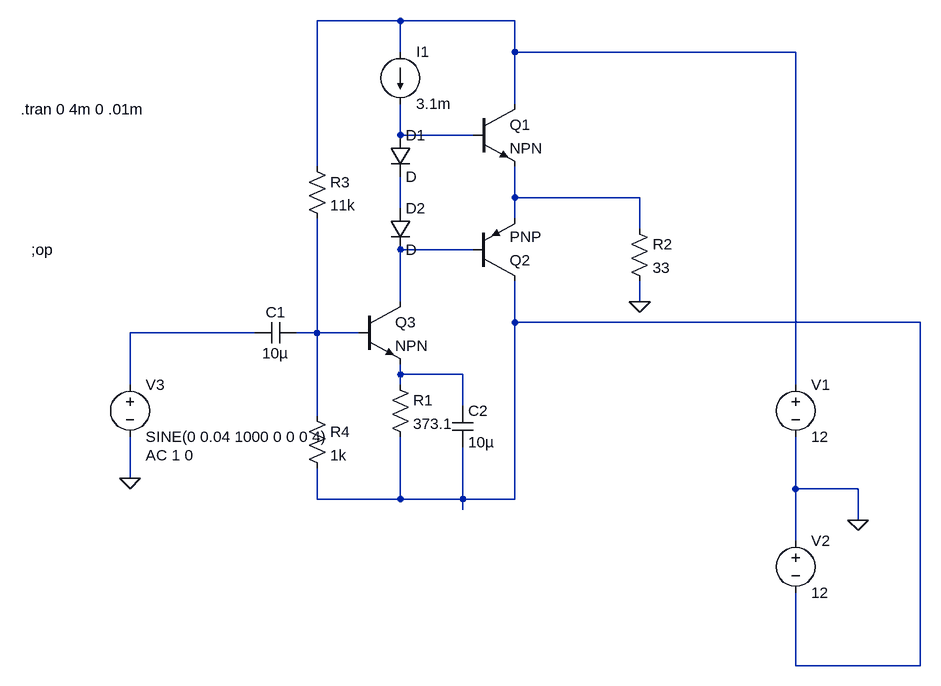
[diagram p0: schematic claseab4.asc]
claseab4.asc, the LTspice schematic file:
Version 4
SHEET 1 884 680
WIRE 80 -560 -48 -560
WIRE 256 -560 80 -560
WIRE 80 -512 80 -560
WIRE 256 -512 256 -560
WIRE 688 -512 256 -512
WIRE 256 -432 256 -512
WIRE 80 -384 80 -432
WIRE 192 -384 80 -384
WIRE -48 -336 -48 -560
WIRE 256 -288 256 -336
WIRE 336 -288 256 -288
WIRE 448 -288 336 -288
WIRE 80 -272 80 -320
WIRE 256 -256 256 -288
WIRE 448 -240 448 -288
WIRE 192 -208 80 -208
WIRE 80 -160 80 -208
WIRE 80 -128 80 -160
WIRE 448 -128 448 -160
WIRE 256 -96 256 -160
WIRE 880 -96 256 -96
WIRE -144 -80 -336 -80
WIRE -48 -80 -48 -256
WIRE -48 -80 -80 -80
WIRE 16 -80 -48 -80
WIRE 80 -16 80 -32
WIRE 176 -16 80 -16
WIRE -336 0 -336 -80
WIRE 80 0 80 -16
WIRE 688 0 688 -512
WIRE 176 32 176 -16
WIRE -48 48 -48 -80
WIRE -336 144 -336 80
WIRE 688 160 688 80
WIRE 784 160 688 160
WIRE -48 176 -48 128
WIRE 80 176 80 80
WIRE 80 176 -48 176
WIRE 176 176 176 96
WIRE 176 176 80 176
WIRE 256 176 256 -96
WIRE 256 176 176 176
WIRE 176 192 176 176
WIRE 784 208 784 160
WIRE 688 240 688 160
WIRE 688 432 688 320
WIRE 880 432 880 -96
WIRE 880 432 688 432
FLAG 784 208 0
FLAG -336 144 0
FLAG 448 -128 0
DATAFLAG 80 -160 ""
DATAFLAG 336 -288 ""
DATAFLAG 80 -16 ""
SYMBOL voltage 688 -16 R0
WINDOW 123 0 0 Left 2
WINDOW 39 0 0 Left 2
SYMATTR InstName V1
SYMATTR Value 12
SYMBOL voltage 688 224 R0
WINDOW 123 0 0 Left 2
WINDOW 39 0 0 Left 2
SYMATTR InstName V2
SYMATTR Value 12
SYMBOL voltage -336 -16 R0
WINDOW 123 24 124 Left 2
WINDOW 39 0 0 Left 2
SYMATTR Value2 AC 1 0
SYMATTR InstName V3
SYMATTR Value SINE(0 0.04 1000 0 0 0 4)
SYMBOL diode 64 -384 R0
SYMATTR InstName D1
SYMBOL diode 64 -272 R0
SYMATTR InstName D2
SYMBOL res 432 -256 R0
SYMATTR InstName R2
SYMATTR Value 33
SYMBOL current 80 -512 R0
WINDOW 123 0 0 Left 2
WINDOW 39 0 0 Left 2
SYMATTR InstName I1
SYMATTR Value 3.1m
SYMBOL npn 192 -432 R0
SYMATTR InstName Q1
SYMBOL pnp 192 -160 M180
SYMATTR InstName Q2
SYMBOL npn 16 -128 R0
SYMATTR InstName Q3
SYMBOL res 64 -16 R0
SYMATTR InstName R1
SYMATTR Value 373.1
SYMBOL res -64 -352 R0
SYMATTR InstName R3
SYMATTR Value 11k
SYMBOL res -64 32 R0
SYMATTR InstName R4
SYMATTR Value 1k
SYMBOL cap -80 -96 R90
WINDOW 0 0 32 VBottom 2
WINDOW 3 32 32 VTop 2
SYMATTR InstName C1
SYMATTR Value 10µ
SYMBOL cap 160 32 R0
SYMATTR InstName C2
SYMATTR Value 10µ
TEXT -504 -424 Left 2 !.tran 0 4m 0 .01m
TEXT -488 -208 Left 2 !;op

The netlist it stands for:
* claseab4.asc
V1 N001 0 12
V2 0 N006 12
V3 N007 0 SINE(0 0.04 1000 0 0 0 4) AC 1 0
D1 N002 N004 D
D2 N004 N005 D
R2 N003 0 33
I1 N001 N002 3.1m
Q1 N001 N002 N003 0 NPN
Q2 N006 N005 N003 0 PNP
Q3 N005 N008 N009 0 NPN
R1 N009 N006 373.1
R3 N001 N008 11k
R4 N008 N006 1k
C1 N008 N007 10µ
C2 N009 N006 10µ
.model D D
.lib standard.dio
.model NPN NPN
.model PNP PNP
.lib standard.bjt
.tran 0 4m 0 .01m
;op
.backanno
.end